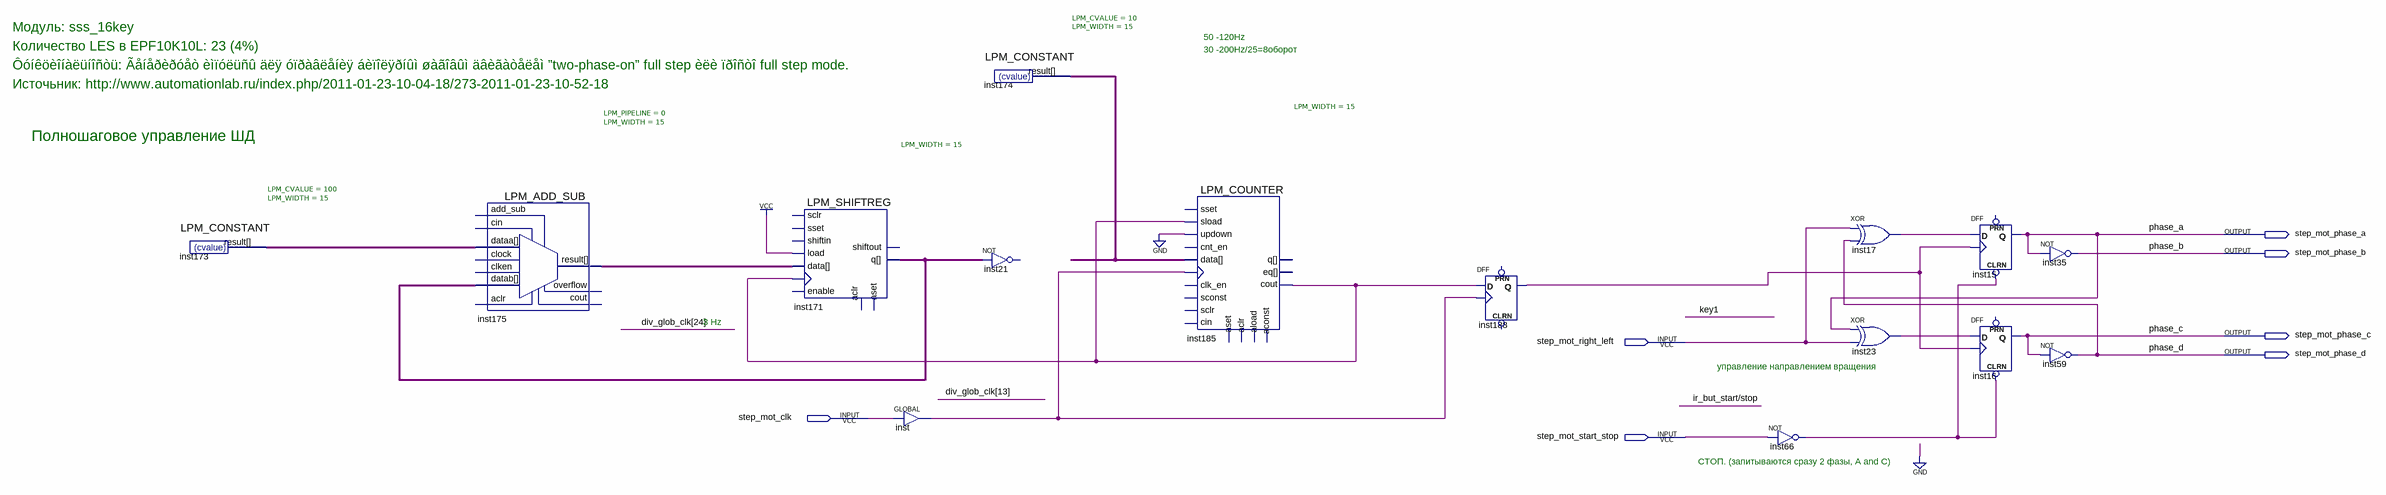
[diagram p0: schematic sheet]
// Quartus schematic sss_step_mot.bdf as structural Verilog: 15 symbols, 7 pins
module sss_step_mot (
  input  step_mot_right_left,
  input  step_mot_clk,
  input  step_mot_start_stop,
  output step_mot_phase_a,
  output step_mot_phase_b,
  output step_mot_phase_c,
  output step_mot_phase_d
);

  wire inst17_out, inst23_out, inst66_out, inst185_cout, inst188_q, inst_out;
  wire [14:0] inst171_q, inst173_result, inst174_result, inst175_result;

  LPM_CONSTANT #(.LPM_CVALUE(100), .LPM_WIDTH(15)) inst173 (.result(inst173_result));
  LPM_ADD_SUB #(.LPM_PIPELINE(0), .LPM_WIDTH(15)) inst175 (
    .datab(inst171_q), .dataa(inst173_result), .result(inst175_result));  // open: add_sub, cin, aclr, clock, clken, cout, overflow
  LPM_SHIFTREG #(.LPM_WIDTH(15)) inst171 (
    .clock(inst185_cout), .data(inst175_result), .load(1'b1), .q(inst171_q));  // open: shiftin, sset, enable, sclr, aset, aclr, shiftout
  GLOBAL inst (.IN(step_mot_clk), .OUT(inst_out));
  LPM_CONSTANT #(.LPM_CVALUE(10), .LPM_WIDTH(15)) inst174 (.result(inst174_result));
  // NOT inst21 has open pins: IN=inst171_q, OUT=open
  LPM_COUNTER #(.LPM_WIDTH(15)) inst185 (
    .sload(inst185_cout), .updown(1'b0), .data(inst174_result), .clock(inst_out), .cout(inst185_cout));  // open: sset, cnt_en, clk_en, sconst, sclr, aload, aclr, aset, aconst, cin, q, eq
  DFF inst188 (.CLK(inst_out), .D(inst185_cout), .Q(inst188_q));  // open: CLRN, PRN
  not inst66 (inst66_out, step_mot_start_stop);
  xor inst17 (inst17_out, step_mot_right_left, step_mot_phase_d);
  xor inst23 (inst23_out, step_mot_phase_a, step_mot_right_left);
  DFF inst15 (.CLRN(inst66_out), .CLK(inst188_q), .D(inst17_out), .Q(step_mot_phase_a));  // open: PRN
  DFF inst16 (.CLRN(inst66_out), .CLK(inst188_q), .D(inst23_out), .Q(step_mot_phase_c));  // open: PRN
  not inst35 (step_mot_phase_b, step_mot_phase_a);
  not inst59 (step_mot_phase_d, step_mot_phase_c);

  // Other names for the same wires on the sheet: phase_a = step_mot_phase_a; phase_b = step_mot_phase_b;
  //   phase_c = step_mot_phase_c; phase_d = step_mot_phase_d

  // Notes on the sheet:
  //   Модуль: sss_16key
  //   50 -120Hz
  //   Количество LES в EPF10K10L: 23 (4%)
  //   30 -200Hz/25=8оборот
  //   Ôóíêöèîíàëüíîñòü: Ãåíåðèðóåò èìïóëüñû äëÿ óïðàâëåíèÿ áèïîëÿðíûì øàãîâûì äâèãàòåëåì ”two-phase-on” full step èëè ïðîñòî full step mode.
  //   Источьник: http://www.automationlab.ru/index.php/2011-01-23-10-04-18/273-2011-01-23-10-52-18
  //   Полношаговое управление ШД
  //   3 Hz
  //   управление направлением вращения
  //   СТОП. (запитываются сразу 2 фазы, A and C)
endmodule
